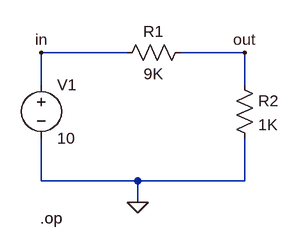
[diagram p0: schematic simple_voltage_divider.asc]
simple_voltage_divider.asc, the LTspice schematic file:
Version 4
SHEET 1 880 680
WIRE 176 64 48 64
WIRE 352 64 256 64
WIRE 48 112 48 64
WIRE 352 112 352 64
WIRE 48 256 48 192
WIRE 192 256 48 256
WIRE 352 256 352 192
WIRE 352 256 192 256
WIRE 192 288 192 256
FLAG 192 288 0
FLAG 48 64 in
FLAG 352 64 out
SYMBOL voltage 48 96 R0
WINDOW 123 0 0 Left 0
WINDOW 39 0 0 Left 0
SYMATTR InstName V1
SYMATTR Value 10
SYMBOL res 336 96 R0
SYMATTR InstName R2
SYMATTR Value 1K
SYMBOL res 272 48 R90
WINDOW 0 0 56 VBottom 2
WINDOW 3 32 56 VTop 2
SYMATTR InstName R1
SYMATTR Value 9K
TEXT 46 312 Left 2 !.op

The netlist it stands for:
* simple_voltage_divider.asc
V1 in 0 10
R2 out 0 1K
R1 out in 9K
.op
.backanno
.end

* Results of the author's LTspice run, read from the files saved beside the schematic
* Operating Point:
*   V(in) = 10 V
*   V(out) = 1 V
*   I(R1) = -1 mA
*   I(R2) = 1 mA
*   I(V1) = -1 mA